# EAGLE design six4mix_power (EAGLE 6.6.0)
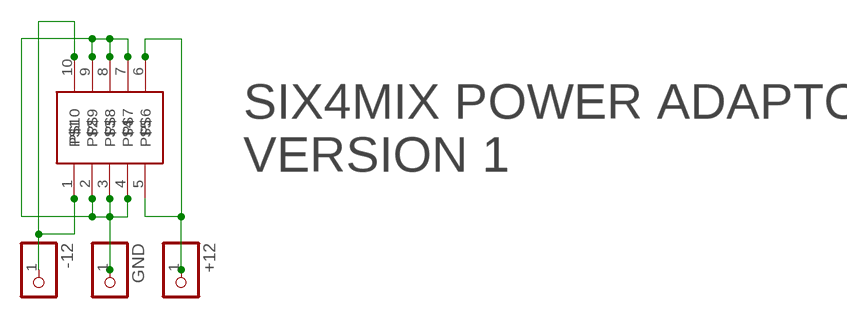
[diagram p0: schematic, sheet 1]

## Parts
+12  PINHD-1X1  [1X01]
-12  PINHD-1X1  [1X01]
GND  PINHD-1X1  [1X01]
U$1  2X5SMT  [2X5SMT]

## Nets
GND: GND.1 U$1.2 U$1.3 U$1.4 U$1.7 U$1.8 U$1.9
N$1: -12.1 U$1.1 U$1.10
N$2: +12.1 U$1.5 U$1.6

## Notes on the sheet
- SIX4MIX POWER ADAPTOR
  VERSION 1

## Library data of the parts
+12 -12 GND = pinhead:PINHD-1X1: PIN HEADER
U$1 = jason_eagle6:2X5SMT

## Board
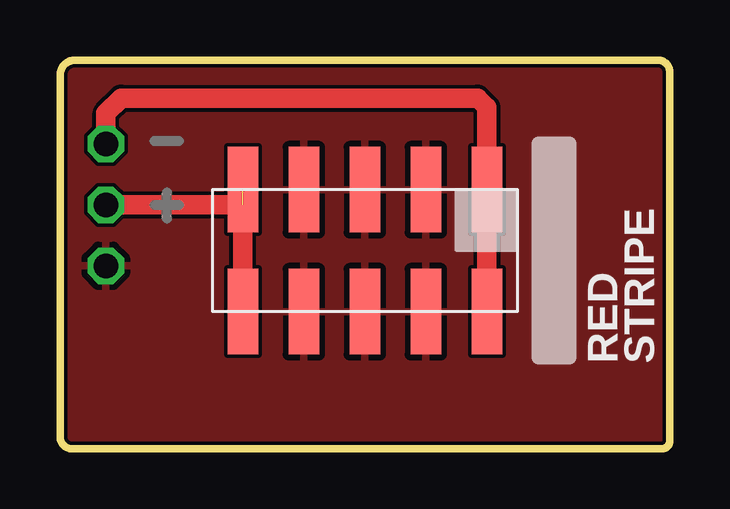
[diagram p1: board, top side]
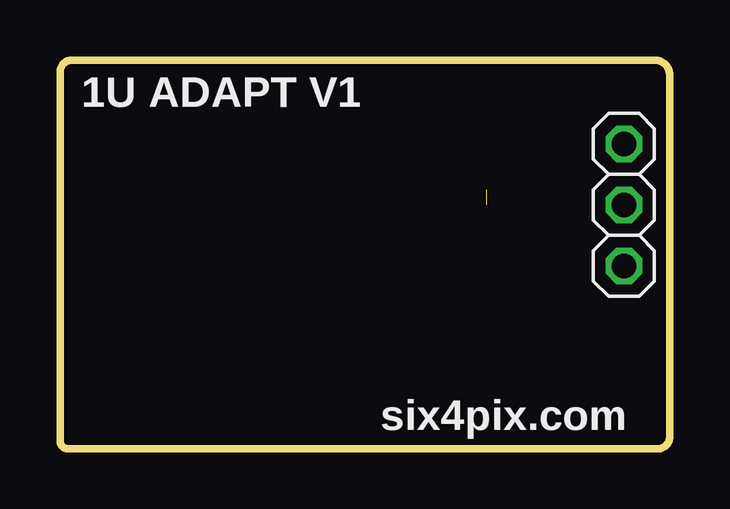
[diagram p2: board, bottom side, seen from below]

Size 25.41 x 16.2 mm. Coordinates in mm from the lower left corner, seen from the top.
Outline: 25.4,15.62 arc90 24.96,16.19 0.7,16.19 arc90 0,15.62 0,0.57 arc90 0.45,0 25.09,0 arc90 25.4,0.32 25.4,15.62
Outline: 25.4,15.69 25.4,15.62
Copper layers (1*16): Top 0.035mm / dielectric 1.5mm / Bottom 0.035mm
Design rules "hackvana": minimum track width 6mil, minimum drill 0.3mm, track to track 6mil, track to pad 9mil, pad to pad 6mil, via to via 6mil, smd to smd 0mil, copper to edge 6mil, drill to drill 6mil, minimum pad ring 10mil, minimum via ring 6mil, stop-mask expansion 2mil, vias tented up to drill 100mil, thermal gap 10mil

### Footprints (pad centres in the part's own frame; a part is rotated, then mirrored left to right if it is on the bottom)
1X01 = drill 1.016 octagon: 1 0,0
2X5SMT = smd 3.56 x 1.27: 1 -2.54,5.08; 2 -2.54,2.54; 3 -2.54,0; 4 -2.54,-2.54; 5 -2.54,-5.08; 6 2.54,-5.08; 7 2.54,-2.54; 8 2.54,0; 9 2.54,2.54; 10 2.54,5.08

### Placement (x,y rotation side)
+12  1.91,10.16 0 bottom
-12  1.91,12.7 0 bottom
GND  1.91,7.62 0 bottom
U$1  12.7,8.26 270 top

### Tracks (layer width: path | path; a pad name or v marks a point on that pad's centre or on a via)
GND
  pour Top: 0.26,16.13 25.4,16.13 25.4,0.13 0.26,0.13
N$1
  Top 0.813: -12.1 1.91,13.97 2.54,14.61 17.4,14.61 17.78,14.22 U$1.1 U$1.10
N$2  (1 unrouted)
  Top 0.813: +12.1 7.62,10.16 U$1.6

### Text on the board
tPlace: RED | STRIPE
bPlace: 1U ADAPT V1 | six4pix.com
tDocu: GD